# Altium schematic sheet FPGA.SchDoc
size A3
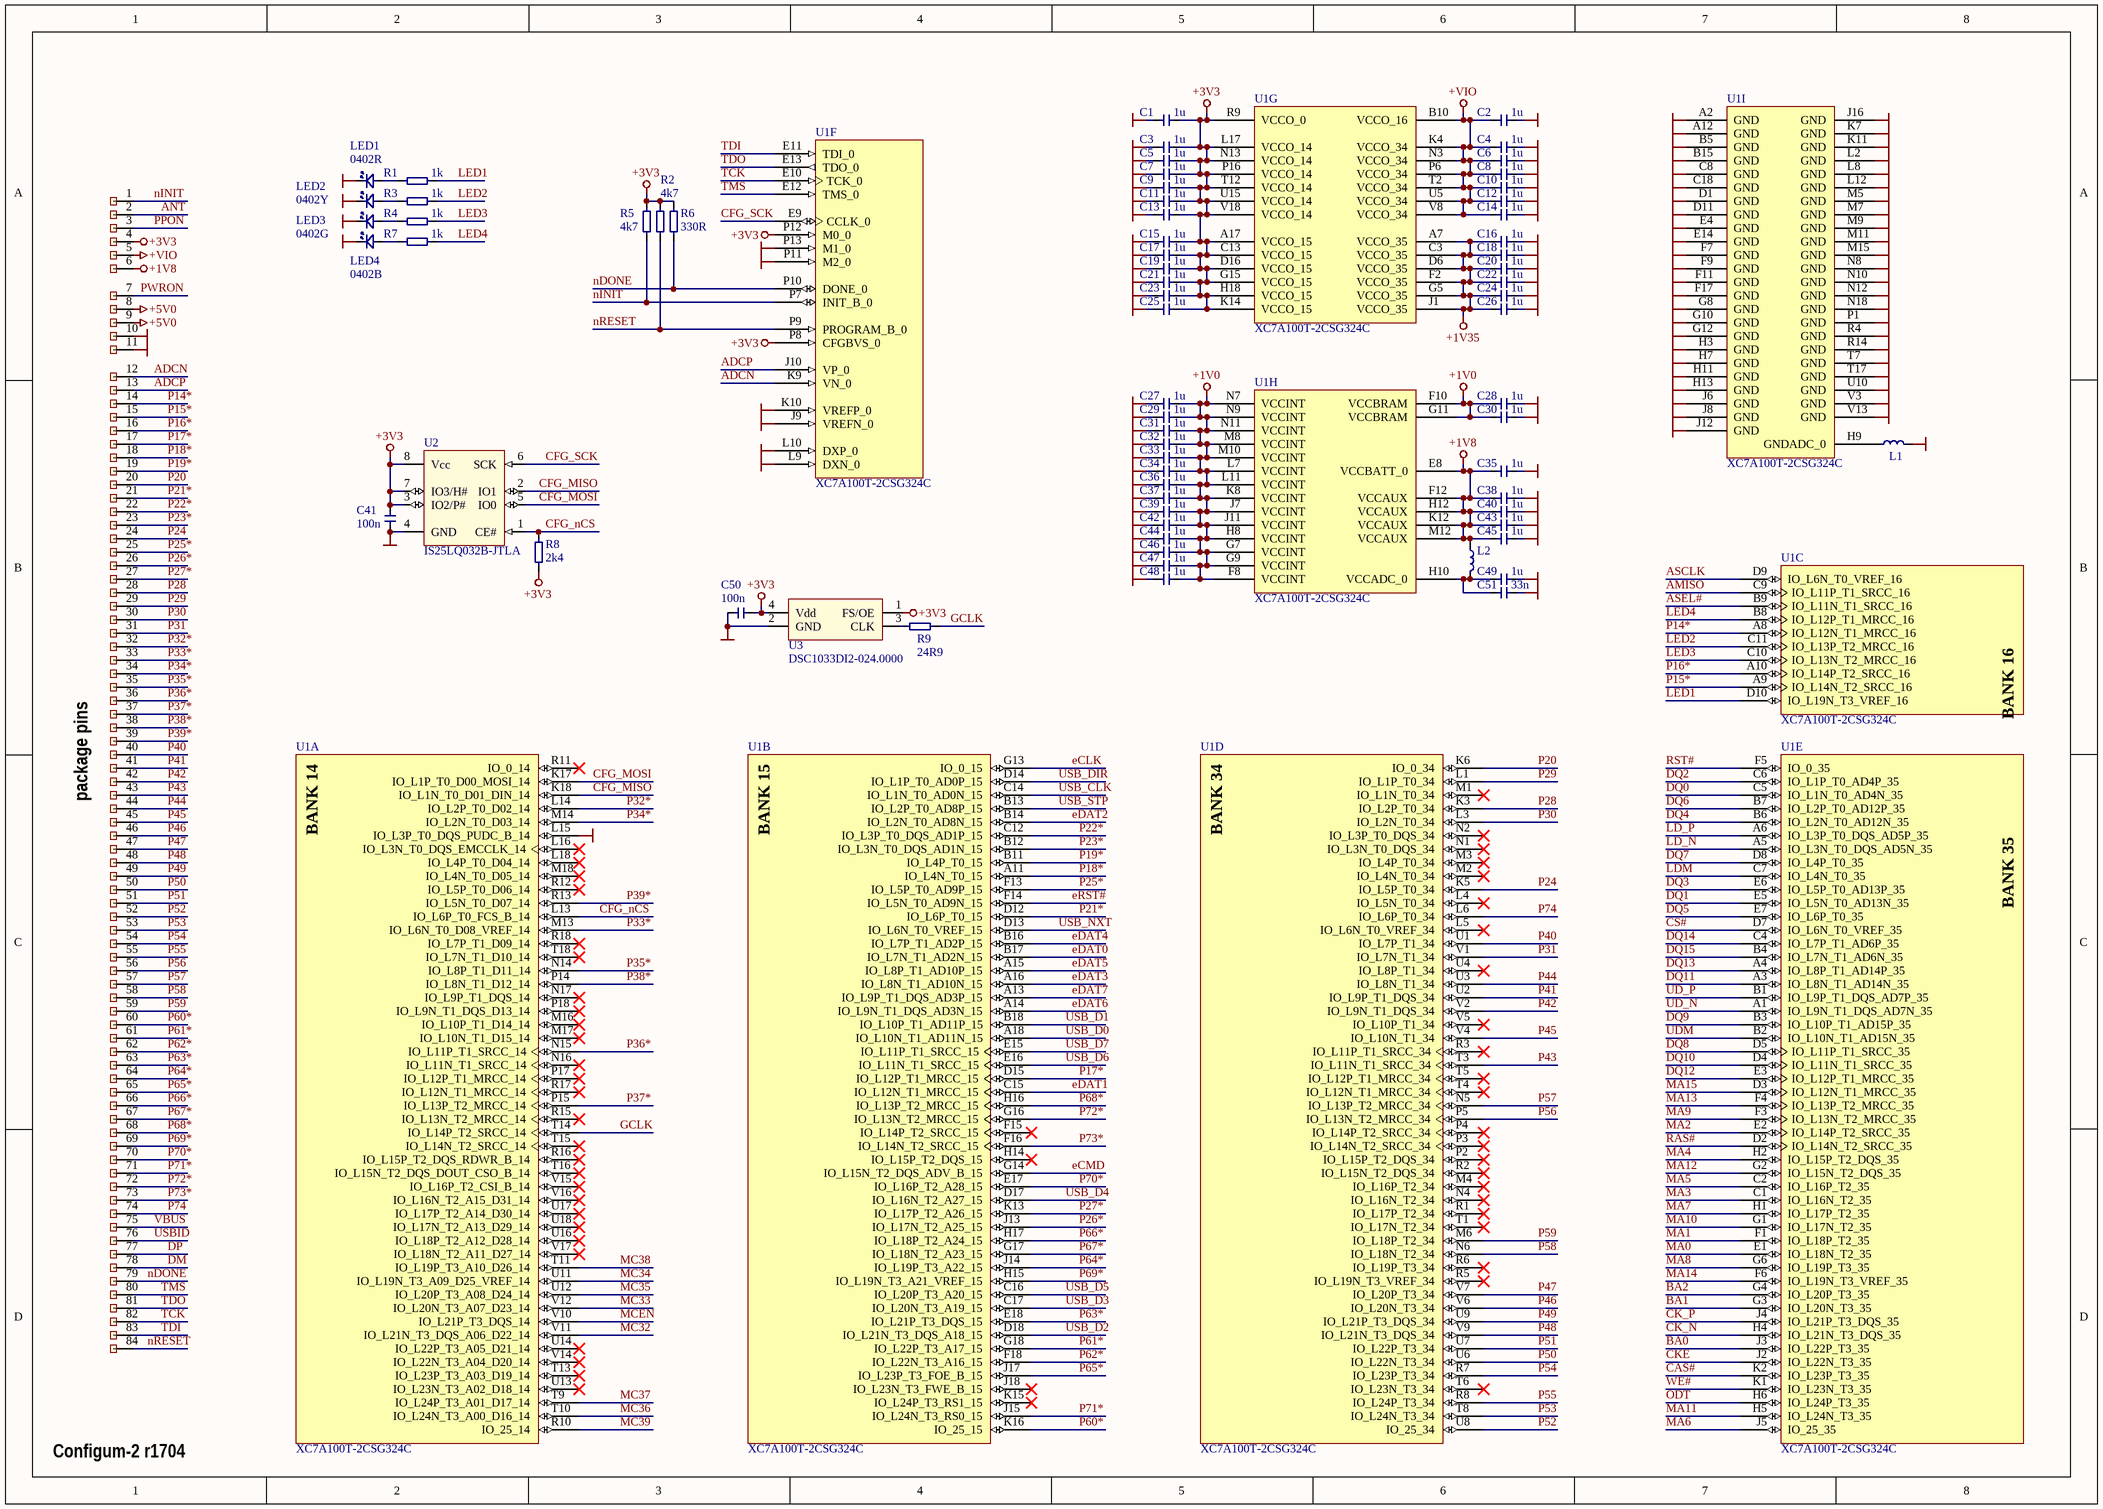
[diagram p0: FPGA.SchDoc]

## Parts
C1  1u  [_0201]
C2  1u  [_0201]
C3  1u  [_0201]
C4  1u  [_0201]
C5  1u  [_0201]
C6  1u  [_0201]
C7  1u  [_0201]
C8  1u  [_0201]
C9  1u  [_0201]
C10  1u  [_0201]
C11  1u  [_0201]
C12  1u  [_0201]
C13  1u  [_0201]
C14  1u  [_0201]
C15  1u  [_0201]
C16  1u  [_0201]
C17  1u  [_0201]
C18  1u  [_0201]
C19  1u  [_0201]
C20  1u  [_0201]
C21  1u  [_0201]
C22  1u  [_0201]
C23  1u  [_0201]
C24  1u  [_0201]
C25  1u  [_0201]
C26  1u  [_0201]
C27  1u  [_0201]
C28  1u  [_0201]
C29  1u  [_0201]
C30  1u  [_0201]
C31  1u  [_0201]
C32  1u  [_0201]
C33  1u  [_0201]
C34  1u  [_0201]
C35  1u  [_0201]
C36  1u  [_0201]
C37  1u  [_0201]
C38  1u  [_0201]
C39  1u  [_0201]
C40  1u  [_0201]
C41  100n  [_0201]
C42  1u  [_0201]
C43  1u  [_0201]
C44  1u  [_0201]
C45  1u  [_0201]
C46  1u  [_0201]
C47  1u  [_0201]
C48  1u  [_0201]
C49  1u  [_0201]
C50  100n  [_0201]
C51  33n  [_0201]
L1  60R/100MHz  [_0201]  (value not drawn)
L2  60R/100MHz  [_0201]  (value not drawn)
LED1  0402R  [_0402+]
LED2  0402Y  [_0402+]
LED3  0402G  [_0402+]
LED4  0402B  [_0402+]
PIN1  Pin/Pad  [PLCC68 pin]  (value not drawn)
PIN2  Pin/Pad  [PLCC68 pin]  (value not drawn)
PIN3  Pin/Pad  [PLCC68 pin]  (value not drawn)
PIN4  Pin/Pad  [PLCC68 pin]  (value not drawn)
PIN5  Pin/Pad  [PLCC68 pin]  (value not drawn)
PIN6  Pin/Pad  [PLCC68 pin]  (value not drawn)
PIN7  Pin/Pad  [PLCC68 pin]  (value not drawn)
PIN8  Pin/Pad  [PLCC68 pin]  (value not drawn)
PIN9  Pin/Pad  [PLCC68 pin]  (value not drawn)
PIN10  Pin/Pad  [PLCC68 pin]  (value not drawn)
PIN11  Pin/Pad  [PLCC68 pin]  (value not drawn)
PIN12  Pin/Pad  [PLCC68 pin]  (value not drawn)
PIN13  Pin/Pad  [PLCC68 pin]  (value not drawn)
PIN14  Pin/Pad  [PLCC68 pin]  (value not drawn)
PIN15  Pin/Pad  [PLCC68 pin]  (value not drawn)
PIN16  Pin/Pad  [PLCC68 pin]  (value not drawn)
PIN17  Pin/Pad  [PLCC68 pin]  (value not drawn)
PIN18  Pin/Pad  [PLCC68 pin]  (value not drawn)
PIN19  Pin/Pad  [PLCC68 pin]  (value not drawn)
PIN20  Pin/Pad  [PLCC68 pin]  (value not drawn)
PIN21  Pin/Pad  [PLCC68 pin]  (value not drawn)
PIN22  Pin/Pad  [PLCC68 pin]  (value not drawn)
PIN23  Pin/Pad  [PLCC68 pin]  (value not drawn)
PIN24  Pin/Pad  [PLCC68 pin]  (value not drawn)
PIN25  Pin/Pad  [PLCC68 pin]  (value not drawn)
PIN26  Pin/Pad  [PLCC68 pin]  (value not drawn)
PIN27  Pin/Pad  [PLCC68 pin]  (value not drawn)
PIN28  Pin/Pad  [PLCC68 pin]  (value not drawn)
PIN29  Pin/Pad  [PLCC68 pin]  (value not drawn)
PIN30  Pin/Pad  [PLCC68 pin]  (value not drawn)
PIN31  Pin/Pad  [PLCC68 pin]  (value not drawn)
PIN32  Pin/Pad  [PLCC68 pin]  (value not drawn)
PIN33  Pin/Pad  [PLCC68 pin]  (value not drawn)
PIN34  Pin/Pad  [PLCC68 pin]  (value not drawn)
PIN35  Pin/Pad  [PLCC68 pin]  (value not drawn)
PIN36  Pin/Pad  [PLCC68 pin]  (value not drawn)
PIN37  Pin/Pad  [PLCC68 pin]  (value not drawn)
PIN38  Pin/Pad  [PLCC68 pin]  (value not drawn)
PIN39  Pin/Pad  [PLCC68 pin]  (value not drawn)
PIN40  Pin/Pad  [PLCC68 pin]  (value not drawn)
PIN41  Pin/Pad  [PLCC68 pin]  (value not drawn)
PIN42  Pin/Pad  [PLCC68 pin]  (value not drawn)
PIN43  Pin/Pad  [PLCC68 pin]  (value not drawn)
PIN44  Pin/Pad  [PLCC68 pin]  (value not drawn)
PIN45  Pin/Pad  [PLCC68 pin]  (value not drawn)
PIN46  Pin/Pad  [PLCC68 pin]  (value not drawn)
PIN47  Pin/Pad  [PLCC68 pin]  (value not drawn)
PIN48  Pin/Pad  [PLCC68 pin]  (value not drawn)
PIN49  Pin/Pad  [PLCC68 pin]  (value not drawn)
PIN50  Pin/Pad  [PLCC68 pin]  (value not drawn)
PIN51  Pin/Pad  [PLCC68 pin]  (value not drawn)
PIN52  Pin/Pad  [PLCC68 pin]  (value not drawn)
PIN53  Pin/Pad  [PLCC68 pin]  (value not drawn)
PIN54  Pin/Pad  [PLCC68 pin]  (value not drawn)
PIN55  Pin/Pad  [PLCC68 pin]  (value not drawn)
PIN56  Pin/Pad  [PLCC68 pin]  (value not drawn)
PIN57  Pin/Pad  [PLCC68 pin]  (value not drawn)
PIN58  Pin/Pad  [PLCC68 pin]  (value not drawn)
PIN59  Pin/Pad  [PLCC68 pin]  (value not drawn)
PIN60  Pin/Pad  [PLCC68 pin]  (value not drawn)
PIN61  Pin/Pad  [PLCC68 pin]  (value not drawn)
PIN62  Pin/Pad  [PLCC68 pin]  (value not drawn)
PIN63  Pin/Pad  [PLCC68 pin]  (value not drawn)
PIN64  Pin/Pad  [PLCC68 pin]  (value not drawn)
PIN65  Pin/Pad  [PLCC68 pin]  (value not drawn)
PIN66  Pin/Pad  [PLCC68 pin]  (value not drawn)
PIN67  Pin/Pad  [PLCC68 pin]  (value not drawn)
PIN68  Pin/Pad  [PLCC68 pin]  (value not drawn)
PIN69  Pin/Pad  [PLCC68 pin]  (value not drawn)
PIN70  Pin/Pad  [PLCC68 pin]  (value not drawn)
PIN71  Pin/Pad  [PLCC68 pin]  (value not drawn)
PIN72  Pin/Pad  [PLCC68 pin]  (value not drawn)
PIN73  Pin/Pad  [PLCC68 pin]  (value not drawn)
PIN74  Pin/Pad  [PLCC68 pin]  (value not drawn)
PIN75  Pin/Pad  [PLCC68 pin]  (value not drawn)
PIN76  Pin/Pad  [PLCC68 pin]  (value not drawn)
PIN77  Pin/Pad  [PLCC68 pin]  (value not drawn)
PIN78  Pin/Pad  [PLCC68 pin]  (value not drawn)
PIN79  Pin/Pad  [PLCC68 pin]  (value not drawn)
PIN80  Pin/Pad  [PLCC68 pin]  (value not drawn)
PIN81  Pin/Pad  [PLCC68 pin]  (value not drawn)
PIN82  Pin/Pad  [PLCC68 pin]  (value not drawn)
PIN83  Pin/Pad  [PLCC68 pin]  (value not drawn)
PIN84  Pin/Pad  [PLCC68 pin]  (value not drawn)
R1  1k  [_0201]
R2  4k7  [_0201]
R3  1k  [_0201]
R4  1k  [_0201]
R5  4k7  [_0201]
R6  330R  [_0201]
R7  1k  [_0201]
R8  2k4  [_0201]
R9  24R9  [_0201]
U1  XC7A100T-2CSG324C  [CSG324]  (parts A,B,C,D,E,F,G,H,I of 9)
U2  IS25LQ032B-JTLA  [SON80P300X60_HS-9L]
U3  DSC1033DI2-024.0000  [Osc 25x20 (4)]

## Nets
+1V0: C27.1 C28.2 C29.1 C30.2 C31.1 C32.1 C33.1 C34.1 C36.1 C37.1 C39.1 C42.1 C44.1 C46.1 C47.1 C48.1 U1.F8(VCCINT) U1.F10(VCCBRAM) U1.G7(VCCINT) U1.G9(VCCINT) U1.G11(VCCBRAM) U1.H8(VCCINT) U1.J7(VCCINT) U1.J11(VCCINT) U1.K8(VCCINT) U1.L7(VCCINT) U1.L11(VCCINT) U1.M8(VCCINT) U1.M10(VCCINT) U1.N7(VCCINT) U1.N9(VCCINT) U1.N11(VCCINT)
+1V8: C35.2 C38.2 C40.2 C43.2 C45.2 L2.2 PIN6.6 U1.E8(VCCBATT_0) U1.F12(VCCAUX) U1.H12(VCCAUX) U1.K12(VCCAUX) U1.M12(VCCAUX)
+1V35: C16.2 C18.2 C20.2 C22.2 C24.2 C26.2 U1.A7(VCCO_35) U1.C3(VCCO_35) U1.D6(VCCO_35) U1.F2(VCCO_35) U1.G5(VCCO_35) U1.J1(VCCO_35)
+3V3: C1.1 C3.1 C5.1 C7.1 C9.1 C11.1 C13.1 C15.1 C17.1 C19.1 C21.1 C23.1 C25.1 C41.2 C50.1 PIN4.4 R2.2 R5.2 R6.1 R8.1 U1.A17(VCCO_15) U1.C13(VCCO_15) U1.D16(VCCO_15) U1.G15(VCCO_15) U1.H18(VCCO_15) U1.K14(VCCO_15) U1.L17(VCCO_14) U1.N13(VCCO_14) U1.P8(CFGBVS_0) U1.P12(M0_0) U1.P16(VCCO_14) U1.R9(VCCO_0) U1.T12(VCCO_14) U1.U15(VCCO_14) U1.V18(VCCO_14) U2.3(IO2/P#) U2.7(IO3/H#) U2.8(Vcc) U3.1(FS/OE) U3.4(Vdd)
+5V0: PIN8.8 PIN9.9
+VIO: C2.2 C4.2 C6.2 C8.2 C10.2 C12.2 C14.2 PIN5.5 U1.B10(VCCO_16) U1.K4(VCCO_34) U1.N3(VCCO_34) U1.P6(VCCO_34) U1.T2(VCCO_34) U1.U5(VCCO_34) U1.V8(VCCO_34)
GND: C1.2 C2.1 C3.2 C4.1 C5.2 C6.1 C7.2 C8.1 C9.2 C10.1 C11.2 C12.1 C13.2 C14.1 C15.2 C16.1 C17.2 C18.1 C19.2 C20.1 C21.2 C22.1 C23.2 C24.1 C25.2 C26.1 C27.2 C28.1 C29.2 C30.1 C31.2 C32.2 C33.2 C34.2 C35.1 C36.2 C37.2 C38.1 C39.2 C40.1 C41.1 C42.2 C43.1 C44.2 C45.1 C46.2 C47.2 C48.2 C49.1 C50.2 C51.1 L1.2 LED1.1 LED2.1 LED3.1 LED4.1 PIN10.10 PIN11.11 U1.A2(GND) U1.A12(GND) U1.B5(GND) U1.B15(GND) U1.C8(GND) U1.C18(GND) U1.D1(GND) U1.D11(GND) U1.E4(GND) U1.E14(GND) U1.F7(GND) U1.F9(GND) U1.F11(GND) U1.F17(GND) U1.G8(GND) U1.G10(GND) U1.G12(GND) U1.H3(GND) U1.H7(GND) U1.H11(GND) U1.H13(GND) U1.J6(GND) U1.J8(GND) U1.J9(VREFN_0) U1.J12(GND) U1.J16(GND) U1.K7(GND) U1.K10(VREFP_0) U1.K11(GND) U1.L2(GND) U1.L8(GND) U1.L9(DXN_0) U1.L10(DXP_0) U1.L12(GND) U1.L15(IO_L3P_T0_DQS_PUDC_B_14) U1.M5(GND) U1.M7(GND) U1.M9(GND) U1.M11(GND) U1.M15(GND) U1.N8(GND) U1.N10(GND) U1.N12(GND) U1.N18(GND) U1.P1(GND) U1.P11(M2_0) U1.P13(M1_0) U1.R4(GND) U1.R14(GND) U1.T7(GND) U1.T17(GND) U1.U10(GND) U1.V3(GND) U1.V13(GND) U2.4(GND) U3.2(GND)
ADCN: PIN12.12 U1.K9(VN_0)
ADCP: PIN13.13 U1.J10(VP_0)
AMISO: U1.C9(IO_L11P_T1_SRCC_16)
ANT: PIN2.2
ASCLK: U1.D9(IO_L6N_T0_VREF_16)
ASEL#: U1.B9(IO_L11N_T1_SRCC_16)
BA0: U1.J3(IO_L22P_T3_35)
BA1: U1.G3(IO_L20N_T3_35)
BA2: U1.G4(IO_L20P_T3_35)
CAS#: U1.K2(IO_L23P_T3_35)
CFG_MISO: U1.K18(IO_L1N_T0_D01_DIN_14) U2.2(IO1)
CFG_MOSI: U1.K17(IO_L1P_T0_D00_MOSI_14) U2.5(IO0)
CFG_nCS: R8.2 U1.L13(IO_L6P_T0_FCS_B_14) U2.1(CE#)
CFG_SCK: U1.E9(CCLK_0) U2.6(SCK)
CK_N: U1.H4(IO_L21N_T3_DQS_35)
CK_P: U1.J4(IO_L21P_T3_DQS_35)
CKE: U1.J2(IO_L22N_T3_35)
CS#: U1.D7(IO_L6N_T0_VREF_35)
DM: PIN78.78
DP: PIN77.77
DQ0: U1.C5(IO_L1N_T0_AD4N_35)
DQ1: U1.E5(IO_L5N_T0_AD13N_35)
DQ2: U1.C6(IO_L1P_T0_AD4P_35)
DQ3: U1.E6(IO_L5P_T0_AD13P_35)
DQ4: U1.B6(IO_L2N_T0_AD12N_35)
DQ5: U1.E7(IO_L6P_T0_35)
DQ6: U1.B7(IO_L2P_T0_AD12P_35)
DQ7: U1.D8(IO_L4P_T0_35)
DQ8: U1.D5(IO_L11P_T1_SRCC_35)
DQ9: U1.B3(IO_L10P_T1_AD15P_35)
DQ10: U1.D4(IO_L11N_T1_SRCC_35)
DQ11: U1.A3(IO_L8N_T1_AD14N_35)
DQ12: U1.E3(IO_L12P_T1_MRCC_35)
DQ13: U1.A4(IO_L8P_T1_AD14P_35)
DQ14: U1.C4(IO_L7P_T1_AD6P_35)
DQ15: U1.B4(IO_L7N_T1_AD6N_35)
eCLK: U1.G13(IO_0_15)
eCMD: U1.G14(IO_L15N_T2_DQS_ADV_B_15)
eDAT0: U1.B17(IO_L7N_T1_AD2N_15)
eDAT1: U1.C15(IO_L12N_T1_MRCC_15)
eDAT2: U1.B14(IO_L2N_T0_AD8N_15)
eDAT3: U1.A16(IO_L8N_T1_AD10N_15)
eDAT4: U1.B16(IO_L7P_T1_AD2P_15)
eDAT5: U1.A15(IO_L8P_T1_AD10P_15)
eDAT6: U1.A14(IO_L9N_T1_DQS_AD3N_15)
eDAT7: U1.A13(IO_L9P_T1_DQS_AD3P_15)
eRST#: U1.F14(IO_L5N_T0_AD9N_15)
GCLK: R9.2 U1.T14(IO_L14P_T2_SRCC_14)
LD_N: U1.A5(IO_L3N_T0_DQS_AD5N_35)
LD_P: U1.A6(IO_L3P_T0_DQS_AD5P_35)
LDM: U1.C7(IO_L4N_T0_35)
LED1: R1.2 U1.D10(IO_L19N_T3_VREF_16)
LED2: R3.2 U1.C11(IO_L13P_T2_MRCC_16)
LED3: R4.2 U1.C10(IO_L13N_T2_MRCC_16)
LED4: R7.2 U1.B8(IO_L12P_T1_MRCC_16)
MA0: U1.E1(IO_L18N_T2_35)
MA1: U1.F1(IO_L18P_T2_35)
MA2: U1.E2(IO_L14P_T2_SRCC_35)
MA3: U1.C1(IO_L16N_T2_35)
MA4: U1.H2(IO_L15P_T2_DQS_35)
MA5: U1.C2(IO_L16P_T2_35)
MA6: U1.J5(IO_25_35)
MA7: U1.H1(IO_L17P_T2_35)
MA8: U1.G6(IO_L19P_T3_35)
MA9: U1.F3(IO_L13N_T2_MRCC_35)
MA10: U1.G1(IO_L17N_T2_35)
MA11: U1.H5(IO_L24N_T3_35)
MA12: U1.G2(IO_L15N_T2_DQS_35)
MA13: U1.F4(IO_L13P_T2_MRCC_35)
MA14: U1.F6(IO_L19N_T3_VREF_35)
MA15: U1.D3(IO_L12N_T1_MRCC_35)
MC32: U1.V11(IO_L21N_T3_DQS_A06_D22_14)
MC33: U1.V12(IO_L20N_T3_A07_D23_14)
MC34: U1.U11(IO_L19N_T3_A09_D25_VREF_14)
MC35: U1.U12(IO_L20P_T3_A08_D24_14)
MC36: U1.T10(IO_L24N_T3_A00_D16_14)
MC37: U1.T9(IO_L24P_T3_A01_D17_14)
MC38: U1.T11(IO_L19P_T3_A10_D26_14)
MC39: U1.R10(IO_25_14)
MCEN: U1.V10(IO_L21P_T3_DQS_14)
nDONE: PIN79.79 R6.2 U1.P10(DONE_0)
nINIT: PIN1.1 R5.1 U1.P7(INIT_B_0)
nRESET: PIN84.84 R2.1 U1.P9(PROGRAM_B_0)
ODT: U1.H6(IO_L24P_T3_35)
P14*: PIN14.14 U1.A8(IO_L12N_T1_MRCC_16)
P15*: PIN15.15 U1.A9(IO_L14N_T2_SRCC_16)
P16*: PIN16.16 U1.A10(IO_L14P_T2_SRCC_16)
P17*: PIN17.17 U1.D15(IO_L12P_T1_MRCC_15)
P18*: PIN18.18 U1.A11(IO_L4N_T0_15)
P19*: PIN19.19 U1.B11(IO_L4P_T0_15)
P20: PIN20.20 U1.K6(IO_0_34)
P21*: PIN21.21 U1.D12(IO_L6P_T0_15)
P22*: PIN22.22 U1.C12(IO_L3P_T0_DQS_AD1P_15)
P23*: PIN23.23 U1.B12(IO_L3N_T0_DQS_AD1N_15)
P24: PIN24.24 U1.K5(IO_L5P_T0_34)
P25*: PIN25.25 U1.F13(IO_L5P_T0_AD9P_15)
P26*: PIN26.26 U1.J13(IO_L17N_T2_A25_15)
P27*: PIN27.27 U1.K13(IO_L17P_T2_A26_15)
P28: PIN28.28 U1.K3(IO_L2P_T0_34)
P29: PIN29.29 U1.L1(IO_L1P_T0_34)
P30: PIN30.30 U1.L3(IO_L2N_T0_34)
P31: PIN31.31 U1.V1(IO_L7N_T1_34)
P32*: PIN32.32 U1.L14(IO_L2P_T0_D02_14)
P33*: PIN33.33 U1.M13(IO_L6N_T0_D08_VREF_14)
P34*: PIN34.34 U1.M14(IO_L2N_T0_D03_14)
P35*: PIN35.35 U1.N14(IO_L8P_T1_D11_14)
P36*: PIN36.36 U1.N15(IO_L11P_T1_SRCC_14)
P37*: PIN37.37 U1.P15(IO_L13P_T2_MRCC_14)
P38*: PIN38.38 U1.P14(IO_L8N_T1_D12_14)
P39*: PIN39.39 U1.R13(IO_L5N_T0_D07_14)
P40: PIN40.40 U1.U1(IO_L7P_T1_34)
P41: PIN41.41 U1.U2(IO_L9P_T1_DQS_34)
P42: PIN42.42 U1.V2(IO_L9N_T1_DQS_34)
P43: PIN43.43 U1.T3(IO_L11N_T1_SRCC_34)
P44: PIN44.44 U1.U3(IO_L8N_T1_34)
P45: PIN45.45 U1.V4(IO_L10N_T1_34)
P46: PIN46.46 U1.V6(IO_L20N_T3_34)
P47: PIN47.47 U1.V7(IO_L20P_T3_34)
P48: PIN48.48 U1.V9(IO_L21N_T3_DQS_34)
P49: PIN49.49 U1.U9(IO_L21P_T3_DQS_34)
P50: PIN50.50 U1.U6(IO_L22N_T3_34)
P51: PIN51.51 U1.U7(IO_L22P_T3_34)
P52: PIN52.52 U1.U8(IO_25_34)
P53: PIN53.53 U1.T8(IO_L24N_T3_34)
P54: PIN54.54 U1.R7(IO_L23P_T3_34)
P55: PIN55.55 U1.R8(IO_L24P_T3_34)
P56: PIN56.56 U1.P5(IO_L13N_T2_MRCC_34)
P57: PIN57.57 U1.N5(IO_L13P_T2_MRCC_34)
P58: PIN58.58 U1.N6(IO_L18N_T2_34)
P59: PIN59.59 U1.M6(IO_L18P_T2_34)
P60*: PIN60.60 U1.K16(IO_25_15)
P61*: PIN61.61 U1.G18(IO_L22P_T3_A17_15)
P62*: PIN62.62 U1.F18(IO_L22N_T3_A16_15)
P63*: PIN63.63 U1.E18(IO_L21P_T3_DQS_15)
P64*: PIN64.64 U1.J14(IO_L19P_T3_A22_15)
P65*: PIN65.65 U1.J17(IO_L23P_T3_FOE_B_15)
P66*: PIN66.66 U1.H17(IO_L18P_T2_A24_15)
P67*: PIN67.67 U1.G17(IO_L18N_T2_A23_15)
P68*: PIN68.68 U1.H16(IO_L13P_T2_MRCC_15)
P69*: PIN69.69 U1.H15(IO_L19N_T3_A21_VREF_15)
P70*: PIN70.70 U1.E17(IO_L16P_T2_A28_15)
P71*: PIN71.71 U1.J15(IO_L24N_T3_RS0_15)
P72*: PIN72.72 U1.G16(IO_L13N_T2_MRCC_15)
P73*: PIN73.73 U1.F16(IO_L14N_T2_SRCC_15)
P74: PIN74.74 U1.L6(IO_L6P_T0_34)
PPON: PIN3.3
PWRON: PIN7.7
RAS#: U1.D2(IO_L14N_T2_SRCC_35)
RST#: U1.F5(IO_0_35)
TCK: PIN82.82 U1.E10(TCK_0)
TDI: PIN83.83 U1.E11(TDI_0)
TDO: PIN81.81 U1.E13(TDO_0)
TMS: PIN80.80 U1.E12(TMS_0)
UD_N: U1.A1(IO_L9N_T1_DQS_AD7N_35)
UD_P: U1.B1(IO_L9P_T1_DQS_AD7P_35)
UDM: U1.B2(IO_L10N_T1_AD15N_35)
USB_CLK: U1.C14(IO_L1N_T0_AD0N_15)
USB_D0: U1.A18(IO_L10N_T1_AD11N_15)
USB_D1: U1.B18(IO_L10P_T1_AD11P_15)
USB_D2: U1.D18(IO_L21N_T3_DQS_A18_15)
USB_D3: U1.C17(IO_L20N_T3_A19_15)
USB_D4: U1.D17(IO_L16N_T2_A27_15)
USB_D5: U1.C16(IO_L20P_T3_A20_15)
USB_D6: U1.E16(IO_L11N_T1_SRCC_15)
USB_D7: U1.E15(IO_L11P_T1_SRCC_15)
USB_DIR: U1.D14(IO_L1P_T0_AD0P_15)
USB_NXT: U1.D13(IO_L6N_T0_VREF_15)
USB_STP: U1.B13(IO_L2P_T0_AD8P_15)
USBID: PIN76.76
VBUS: PIN75.75
WE#: U1.K1(IO_L23N_T3_35)
NetC49_2: C49.2 C51.2 L2.1 U1.H10(VCCADC_0)
NetL1_1: L1.1 U1.H9(GNDADC_0)
NetLED1_2: LED1.2 R1.1
NetLED2_2: LED2.2 R3.1
NetLED3_2: LED3.2 R4.1
NetLED4_2: LED4.2 R7.1
NetR9_1: R9.1 U3.3(CLK)

Not connected (* = marked no-connect by the designer): U1 F15(IO_L14P_T2_SRCC_15)* H14(IO_L15P_T2_DQS_15)* J18(IO_L23N_T3_FWE_B_15)* K15(IO_L24P_T3_RS1_15)* L4(IO_L5N_T0_34)* L5(IO_L6N_T0_VREF_34)* L16(IO_L3N_T0_DQS_EMCCLK_14)* L18(IO_L4P_T0_D04_14)* M1(IO_L1N_T0_34)* M2(IO_L4N_T0_34)* M3(IO_L4P_T0_34)* M4(IO_L16P_T2_34)* M16(IO_L10P_T1_D14_14)* M17(IO_L10N_T1_D15_14)* M18(IO_L4N_T0_D05_14)* N1(IO_L3N_T0_DQS_34)* N2(IO_L3P_T0_DQS_34)* N4(IO_L16N_T2_34)* N16(IO_L11N_T1_SRCC_14)* N17(IO_L9P_T1_DQS_14)* P2(IO_L15P_T2_DQS_34)* P3(IO_L14N_T2_SRCC_34)* P4(IO_L14P_T2_SRCC_34)* P17(IO_L12P_T1_MRCC_14)* P18(IO_L9N_T1_DQS_D13_14)* R1(IO_L17P_T2_34)* R2(IO_L15N_T2_DQS_34)* R3(IO_L11P_T1_SRCC_34)* R5(IO_L19N_T3_VREF_34)* R6(IO_L19P_T3_34)* R11(IO_0_14)* R12(IO_L5P_T0_D06_14)* R15(IO_L13N_T2_MRCC_14)* R16(IO_L15P_T2_DQS_RDWR_B_14)* R17(IO_L12N_T1_MRCC_14)* R18(IO_L7P_T1_D09_14)* T1(IO_L17N_T2_34)* T4(IO_L12N_T1_MRCC_34)* T5(IO_L12P_T1_MRCC_34)* T6(IO_L23N_T3_34)* T13(IO_L23P_T3_A03_D19_14)* T15(IO_L14N_T2_SRCC_14)* T16(IO_L15N_T2_DQS_DOUT_CSO_B_14)* T18(IO_L7N_T1_D10_14)* U4(IO_L8P_T1_34)* U13(IO_L23N_T3_A02_D18_14)* U14(IO_L22P_T3_A05_D21_14)* U16(IO_L18P_T2_A12_D28_14)* U17(IO_L17P_T2_A14_D30_14)* U18(IO_L17N_T2_A13_D29_14)* V5(IO_L10P_T1_34)* V14(IO_L22N_T3_A04_D20_14)* V15(IO_L16P_T2_CSI_B_14)* V16(IO_L16N_T2_A15_D31_14)* V17(IO_L18N_T2_A11_D27_14)*

## Notes on the sheet
- package pins
- Configum-2 r1704
- (in symbol XC7A100T-2CSG324C, part A) BANK 14
- (in symbol XC7A100T-2CSG324C, part B) BANK 15
- (in symbol XC7A100T-2CSG324C, part C) BANK 16
- (in symbol XC7A100T-2CSG324C, part D) BANK 34
- (in symbol XC7A100T-2CSG324C, part E) BANK 35

## Library data of the parts
C1-C51 = Capacitor
L1 L2 = Inductor
LED1-LED4 = LED: Light Emitting Diode
PIN1-PIN84 = Pin/Pad: Single pin/pad
R1-R9 = Resistor
  R1 R3 R4 R7 R9: Digikey: RMCF0402FT3K30CT-ND
U1 = XC7A100T-2CSG324C: Artix-7 FPGA, 210 User I/Os, 0 GTP, 324-Ball BGA, Speed Grade 2, Commercial Grade, Pb-Free; Manufacturer: Xilinx; Block RAM Blocks (18Kb): 270; Block RAM Blocks (36Kb): 135; Block RAM Blocks (Max Kb): 4860; CLBs (Slices): 15850; Clock Mgmt Tiles (CMTs): 6; DSP48E1 Slices: 240; Logic Cells: 101440; Max User I/O: 300; Speed Grade: -2; DatasheetVersion: v1.12; PackageVersion: Rev 1.8; PackageReference: CSG324; PackageDescription: Wire-Bond Chip-Scale BGA, Body 15 x 15 mm, 0.8 mm Pitch; CLBs (Max Distributed RAM Kb): 1188; Generic Part Number: XC7A100T; RoHS: Pb-Free; Mounting Technology: Surface Mount; Code_JEDEC: MO-275-KKAC-1; PartNumber: XC7A100T-2CSG324C; ComponentLink1Description: Datasheet; ComponentLink1URL: http://www.xilinx.com/support/documentation/data_sheets/ds180_7Series_Overview.pdf; ComponentLink2Description: Package Specification; ComponentLink2URL: http://www.xilinx.com/support/documentation/user_guides/ug475_7Series_Pkg_Pinout.pdf; ComponentLink3Description: DC and Switching Characteristics; ComponentLink3URL: http://www.xilinx.com/support/documentation/data_sheets/ds181_Artix_7_Data_Sheet.pdf; ComponentLink4Description: Package File; ComponentLink4URL: http://www.xilinx.com/support/packagefiles/a7packages/xc7a100tcsg324pkg.txt; ComponentLink5Description: Packaging and Pinout; ComponentLink5URL: http://www.xilinx.com/support/documentation/user_guides/ug475_7Series_Pkg_Pinout.pdf
U2 = SPI Flash 8pin: Standard 8-pin SPI flash memory
U3 = Si50x: 32kHz –100MHz CMEMS Oscillator; Manufacturer: Silicon Labs; Option: Si501 (one frequency); Option: Si502 (dual selectable frequency); Option: Si503 (quad selectable frequency)